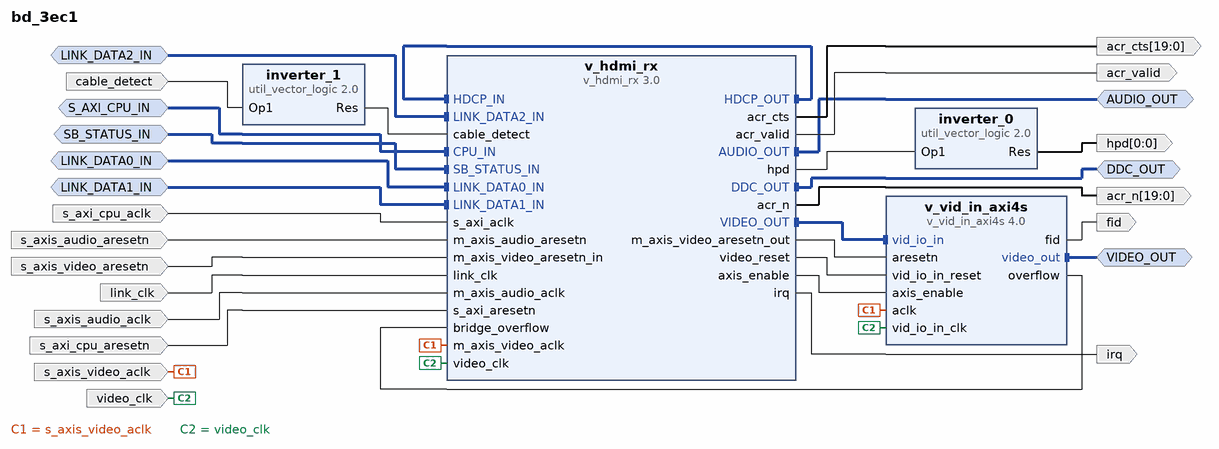
[diagram p0: block diagram of the top level]
# Vivado block design bd_3ec1, xc7z045ffg900-2, Vivado 2020.2
create_bd_design bd_3ec1

create_bd_intf_port -mode Slave -vlnv xilinx.com:interface:axis_rtl:1.0 LINK_DATA0_IN
create_bd_intf_port -mode Slave -vlnv xilinx.com:interface:axis_rtl:1.0 LINK_DATA1_IN
create_bd_intf_port -mode Slave -vlnv xilinx.com:interface:axis_rtl:1.0 LINK_DATA2_IN
create_bd_intf_port -mode Slave -vlnv xilinx.com:interface:aximm_rtl:1.0 S_AXI_CPU_IN
set_property -dict {CONFIG.ADDR_WIDTH 16 CONFIG.PROTOCOL AXI4LITE} [get_bd_intf_ports S_AXI_CPU_IN]
create_bd_intf_port -mode Master -vlnv xilinx.com:interface:axis_rtl:1.0 AUDIO_OUT
create_bd_intf_port -mode Master -vlnv xilinx.com:interface:iic_rtl:1.0 DDC_OUT
create_bd_intf_port -mode Slave -vlnv xilinx.com:interface:axis_rtl:1.0 SB_STATUS_IN
create_bd_intf_port -mode Master -vlnv xilinx.com:interface:axis_rtl:1.0 VIDEO_OUT
set_property -dict [list \
  CONFIG.LAYERED_METADATA {xilinx.com:interface:datatypes:1.0 {TDATA {datatype {name {attribs {resolve_type immediate dependency {} format string minimum {} maximum {}} value xilinx.com:video:G_B_R_444:1.0} bitwidth {attribs {resolve_type automatic dependency {} format long minimum {} maximum {}} value 24} bitoffset {attribs {resolve_type immediate dependency {} format long minimum {} maximum {}} value 0} array_type {name {attribs {resolve_type immediate dependency {} format string minimum {} maximum {}} value rows} size {attribs {resolve_type generated dependency active_rows format long minimum {} maximum {}} value 1} stride {attribs {resolve_type generated dependency active_rows_stride format long minimum {} maximum {}} value 24} datatype {name {attribs {resolve_type immediate dependency {} format string minimum {} maximum {}} value {}} bitwidth {attribs {resolve_type automatic dependency {} format long minimum {} maximum {}} value 24} bitoffset {attribs {resolve_type immediate dependency {} format long minimum {} maximum {}} value 0} array_type {name {attribs {resolve_type immediate dependency {} format string minimum {} maximum {}} value cols} size {attribs {resolve_type generated dependency active_cols format long minimum {} maximum {}} value 1} stride {attribs {resolve_type generated dependency active_cols_stride format long minimum {} maximum {}} value 24} datatype {name {attribs {resolve_type immediate dependency {} format string minimum {} maximum {}} value {}} bitwidth {attribs {resolve_type automatic dependency {} format long minimum {} maximum {}} value 24} bitoffset {attribs {resolve_type immediate dependency {} format long minimum {} maximum {}} value 0} struct {field_G {name {attribs {resolve_type immediate dependency {} format string minimum {} maximum {}} value G} enabled {attribs {resolve_type immediate dependency {} format bool minimum {} maximum {}} value true} datatype {name {attribs {resolve_type immediate dependency {} format string minimum {} maximum {}} value {}} bitwidth {attribs {resolve_type generated dependency video_data_width format long minimum {} maximum {}} value 8} bitoffset {attribs {resolve_type immediate dependency {} format long minimum {} maximum {}} value 0} integer {signed {attribs {resolve_type immediate dependency {} format bool minimum {} maximum {}} value true}}}} field_B {name {attribs {resolve_type immediate dependency {} format string minimum {} maximum {}} value B} enabled {attribs {resolve_type generated dependency video_comp1_enabled format bool minimum {} maximum {}} value true} datatype {name {attribs {resolve_type immediate dependency {} format string minimum {} maximum {}} value {}} bitwidth {attribs {resolve_type generated dependency video_data_width format long minimum {} maximum {}} value 8} bitoffset {attribs {resolve_type generated dependency video_comp1_offset format long minimum {} maximum {}} value 8} integer {signed {attribs {resolve_type immediate dependency {} format bool minimum {} maximum {}} value true}}}} field_R {name {attribs {resolve_type immediate dependency {} format string minimum {} maximum {}} value R} enabled {attribs {resolve_type generated dependency video_comp2_enabled format bool minimum {} maximum {}} value true} datatype {name {attribs {resolve_type immediate dependency {} format string minimum {} maximum {}} value {}} bitwidth {attribs {resolve_type generated dependency video_data_width format long minimum {} maximum {}} value 8} bitoffset {attribs {resolve_type generated dependency video_comp2_offset format long minimum {} maximum {}} value 16} integer {signed {attribs {resolve_type immediate dependency {} format bool minimum {} maximum {}} value true}}}}}}}}}}} TDATA_WIDTH 24}} \
] [get_bd_intf_ports VIDEO_OUT]
create_bd_port -dir I -type clk s_axi_cpu_aclk
set_property -dict [list \
  CONFIG.ASSOCIATED_BUSIF SB_STATUS_IN:S_AXI_CPU_IN \
  CONFIG.ASSOCIATED_RESET s_axi_cpu_aresetn \
] [get_bd_ports s_axi_cpu_aclk]
create_bd_port -dir I -type rst s_axi_cpu_aresetn
create_bd_port -dir I cable_detect
create_bd_port -dir I -type clk link_clk
create_bd_port -dir I -type clk s_axis_audio_aclk
set_property -dict [list \
  CONFIG.ASSOCIATED_BUSIF AUDIO_OUT \
  CONFIG.ASSOCIATED_RESET s_axis_audio_aresetn \
] [get_bd_ports s_axis_audio_aclk]
create_bd_port -dir I -type rst s_axis_audio_aresetn
create_bd_port -dir O -from 19 -to 0 acr_cts
create_bd_port -dir O -from 19 -to 0 acr_n
create_bd_port -dir O acr_valid
create_bd_port -dir O -from 0 -to 0 hpd
create_bd_port -dir O -type intr irq
create_bd_port -dir I -type clk video_clk
create_bd_port -dir O fid
create_bd_port -dir I -type rst s_axis_video_aresetn
create_bd_port -dir I -type clk s_axis_video_aclk
set_property -dict [list \
  CONFIG.ASSOCIATED_BUSIF VIDEO_OUT \
  CONFIG.ASSOCIATED_RESET s_axis_video_aresetn \
] [get_bd_ports s_axis_video_aclk]

create_bd_cell -type ip -vlnv xilinx.com:ip:v_hdmi_rx:3.0 v_hdmi_rx
set_property -dict [list \
  CONFIG.C_BITS_PER_COMPONENT 8 \
  CONFIG.C_CH_WIDTH 8 \
  CONFIG.C_DDC_EDID_SIZE 256 \
  CONFIG.C_HDCP_IF_ENABLE 0 \
  CONFIG.C_PIXELS_PER_CLOCK 4 \
  CONFIG.C_RELAX_DVI_CONSTRAINT 0 \
  CONFIG.C_SIM_DEVICE VERSAL_AI_CORE_ES1 \
  CONFIG.C_SIM_DEVICE_EN 0 \
  CONFIG.C_VECTOR_DE_ENABLE 0 \
] [get_bd_cells v_hdmi_rx]
create_bd_cell -type ip -vlnv xilinx.com:ip:v_vid_in_axi4s:4.0 v_vid_in_axi4s
set_property -dict [list \
  CONFIG.C_ADDR_WIDTH 10 \
  CONFIG.C_ADDR_WIDTH_PIXEL_REMAP_420 10 \
  CONFIG.C_HAS_ASYNC_CLK 1 \
  CONFIG.C_INCLUDE_PIXEL_DROP 0 \
  CONFIG.C_INCLUDE_PIXEL_REMAP_420 0 \
  CONFIG.C_M_AXIS_VIDEO_DATA_WIDTH 8 \
  CONFIG.C_NATIVE_COMPONENT_WIDTH 8 \
  CONFIG.C_PIXELS_PER_CLOCK 4 \
] [get_bd_cells v_vid_in_axi4s]
create_bd_cell -type ip -vlnv xilinx.com:ip:util_vector_logic:2.0 inverter_0
set_property -dict {CONFIG.C_OPERATION not CONFIG.C_SIZE 1} [get_bd_cells inverter_0]
create_bd_cell -type ip -vlnv xilinx.com:ip:util_vector_logic:2.0 inverter_1
set_property -dict {CONFIG.C_OPERATION not CONFIG.C_SIZE 1} [get_bd_cells inverter_1]

# ---- connections ----

connect_bd_intf_net -intf_net intf_net_v_hdmi_rx_DDC_OUT [get_bd_intf_ports DDC_OUT] [get_bd_intf_pins v_hdmi_rx/DDC_OUT]
connect_bd_intf_net -intf_net intf_net_bdry_in_LINK_DATA2_IN [get_bd_intf_ports LINK_DATA2_IN] [get_bd_intf_pins v_hdmi_rx/LINK_DATA2_IN]
connect_bd_intf_net -intf_net intf_net_bdry_in_S_AXI_CPU_IN [get_bd_intf_ports S_AXI_CPU_IN] [get_bd_intf_pins v_hdmi_rx/CPU_IN]
connect_bd_intf_net -intf_net intf_net_bdry_in_SB_STATUS_IN [get_bd_intf_ports SB_STATUS_IN] [get_bd_intf_pins v_hdmi_rx/SB_STATUS_IN]
connect_bd_intf_net -intf_net intf_net_bdry_in_LINK_DATA0_IN [get_bd_intf_ports LINK_DATA0_IN] [get_bd_intf_pins v_hdmi_rx/LINK_DATA0_IN]
connect_bd_intf_net -intf_net intf_net_v_hdmi_rx_hdcp_out [get_bd_intf_pins v_hdmi_rx/HDCP_OUT] [get_bd_intf_pins v_hdmi_rx/HDCP_IN]
connect_bd_intf_net -intf_net intf_net_v_hdmi_rx_VIDEO_OUT [get_bd_intf_pins v_hdmi_rx/VIDEO_OUT] [get_bd_intf_pins v_vid_in_axi4s/vid_io_in]
connect_bd_intf_net -intf_net intf_net_v_hdmi_rx_AUDIO_OUT [get_bd_intf_ports AUDIO_OUT] [get_bd_intf_pins v_hdmi_rx/AUDIO_OUT]
connect_bd_intf_net -intf_net intf_net_bdry_in_LINK_DATA1_IN [get_bd_intf_ports LINK_DATA1_IN] [get_bd_intf_pins v_hdmi_rx/LINK_DATA1_IN]
connect_bd_intf_net -intf_net intf_net_v_vid_in_axi4s_VIDEO_OUT [get_bd_intf_ports VIDEO_OUT] [get_bd_intf_pins v_vid_in_axi4s/video_out]
connect_bd_net -net net_bdry_in_s_axi_cpu_aclk [get_bd_ports s_axi_cpu_aclk] [get_bd_pins v_hdmi_rx/s_axi_aclk]
connect_bd_net -net net_bdry_in_cable_detect [get_bd_ports cable_detect] [get_bd_pins inverter_1/Op1]
connect_bd_net -net net_bdry_in_s_axis_audio_aresetn [get_bd_ports s_axis_audio_aresetn] [get_bd_pins v_hdmi_rx/m_axis_audio_aresetn]
connect_bd_net -net net_bdry_in_s_axis_video_aresetn [get_bd_ports s_axis_video_aresetn] [get_bd_pins v_hdmi_rx/m_axis_video_aresetn_in]
connect_bd_net -net net_bdry_in_s_axis_video_aclk [get_bd_ports s_axis_video_aclk] \
  [get_bd_pins v_hdmi_rx/m_axis_video_aclk] [get_bd_pins v_vid_in_axi4s/aclk]
connect_bd_net -net net_bdry_in_link_clk [get_bd_ports link_clk] [get_bd_pins v_hdmi_rx/link_clk]
connect_bd_net -net net_bdry_in_video_clk [get_bd_ports video_clk] [get_bd_pins v_hdmi_rx/video_clk] [get_bd_pins v_vid_in_axi4s/vid_io_in_clk]
connect_bd_net -net net_bdry_in_s_axis_audio_aclk [get_bd_ports s_axis_audio_aclk] [get_bd_pins v_hdmi_rx/m_axis_audio_aclk]
connect_bd_net -net net_bdry_in_s_axi_cpu_aresetn [get_bd_ports s_axi_cpu_aresetn] [get_bd_pins v_hdmi_rx/s_axi_aresetn]
connect_bd_net -net net_inverter_1_Res [get_bd_pins inverter_1/Res] [get_bd_pins v_hdmi_rx/cable_detect]
connect_bd_net -net net_v_hdmi_rx_acr_valid [get_bd_pins v_hdmi_rx/acr_valid] [get_bd_ports acr_valid]
connect_bd_net -net net_v_hdmi_rx_irq [get_bd_pins v_hdmi_rx/irq] [get_bd_ports irq]
connect_bd_net -net net_v_hdmi_rx_hpd [get_bd_pins v_hdmi_rx/hpd] [get_bd_pins inverter_0/Op1]
connect_bd_net -net net_v_hdmi_rx_m_axis_video_aresetn_out [get_bd_pins v_hdmi_rx/m_axis_video_aresetn_out] [get_bd_pins v_vid_in_axi4s/aresetn]
connect_bd_net -net net_v_hdmi_rx_acr_cts [get_bd_pins v_hdmi_rx/acr_cts] [get_bd_ports acr_cts]
connect_bd_net -net net_v_hdmi_rx_video_reset [get_bd_pins v_hdmi_rx/video_reset] [get_bd_pins v_vid_in_axi4s/vid_io_in_reset]
connect_bd_net -net net_v_hdmi_rx_axis_enable [get_bd_pins v_hdmi_rx/axis_enable] [get_bd_pins v_vid_in_axi4s/axis_enable]
connect_bd_net -net net_v_hdmi_rx_acr_n [get_bd_pins v_hdmi_rx/acr_n] [get_bd_ports acr_n]
connect_bd_net -net net_inverter_0_Res [get_bd_pins inverter_0/Res] [get_bd_ports hpd]
connect_bd_net -net net_v_vid_in_axi4s_fid [get_bd_pins v_vid_in_axi4s/fid] [get_bd_ports fid]
connect_bd_net -net net_v_vid_in_axi4s_overflow [get_bd_pins v_vid_in_axi4s/overflow] [get_bd_pins v_hdmi_rx/bridge_overflow]

# ---- address map ----
assign_bd_address -offset 0x0000 -range 64K -target_address_space [get_bd_addr_spaces S_AXI_CPU_IN] [get_bd_addr_segs v_hdmi_rx/CPU_IN/reg0]

validate_bd_design
save_bd_design
